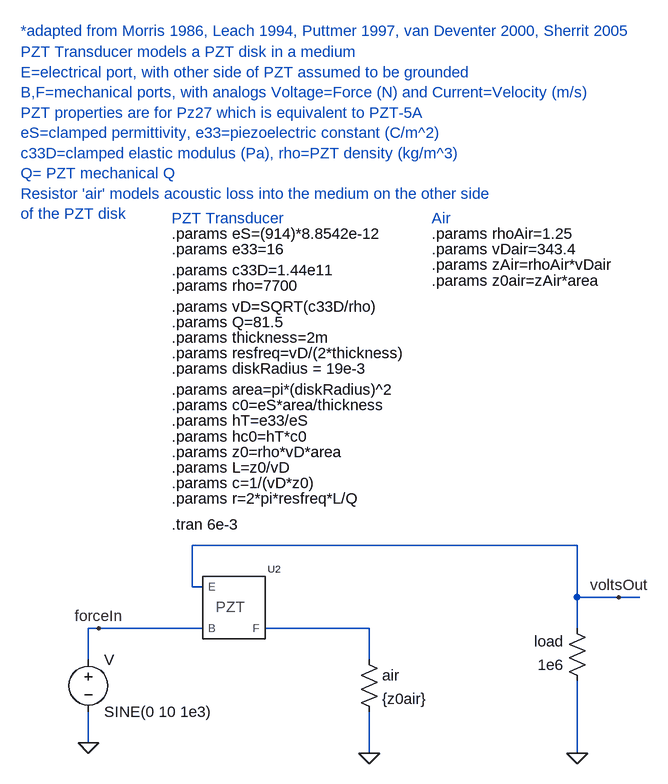
[diagram p0: schematic pzt.asc]
pzt.asc, the LTspice schematic file:
Version 4
SHEET 1 952 680
WIRE 464 48 -128 48
WIRE -128 112 -128 48
WIRE -112 112 -128 112
WIRE 464 128 464 48
WIRE 528 128 464 128
WIRE 560 128 528 128
WIRE -272 176 -288 176
WIRE -112 176 -272 176
WIRE 144 176 -16 176
WIRE 464 176 464 128
WIRE -288 224 -288 176
WIRE 144 224 144 176
WIRE -288 352 -288 304
WIRE 144 368 144 304
WIRE 464 368 464 256
FLAG -288 352 0
FLAG 464 368 0
FLAG 528 128 voltsOut
FLAG -272 176 forceIn
FLAG 144 368 0
SYMBOL res 128 208 R0
SYMATTR InstName air
SYMATTR Value {z0air}
SYMBOL res 480 272 R180
WINDOW 0 36 76 Left 0
WINDOW 3 36 40 Left 0
SYMATTR InstName load
SYMATTR Value 1e6
SYMBOL voltage -288 208 R0
WINDOW 123 0 0 Left 0
WINDOW 39 0 0 Left 0
SYMATTR InstName V
SYMATTR Value SINE(0 10 1e3)
SYMBOL PZT -64 144 R0
SYMATTR InstName U2
TEXT -160 16 Left 0 !.tran 6e-3
TEXT -392 -744 Left 0 ;*adapted from Morris 1986, Leach 1994, Puttmer 1997, van Deventer 2000, Sherrit 2005
TEXT 240 -456 Left 0 ;Air
TEXT -160 -408 Left 0 !.params e33=16
TEXT -160 -352 Left 0 !.params rho=7700
TEXT -160 -320 Left 0 !.params vD=SQRT(c33D/rho)
TEXT -160 -272 Left 0 !.params thickness=2m
TEXT -160 -296 Left 0 !.params Q=81.5
TEXT -160 -248 Left 0 !.params resfreq=vD/(2*thickness)
TEXT -160 -456 Left 0 ;PZT Transducer
TEXT -160 -192 Left 0 !.params area=pi*(diskRadius)^2
TEXT -160 -168 Left 0 !.params c0=eS*area/thickness
TEXT -160 -144 Left 0 !.params hT=e33/eS
TEXT -160 -120 Left 0 !.params hc0=hT*c0
TEXT -160 -24 Left 0 !.params r=2*pi*resfreq*L/Q
TEXT -160 -72 Left 0 !.params L=z0/vD
TEXT -160 -96 Left 0 !.params z0=rho*vD*area
TEXT -160 -48 Left 0 !.params c=1/(vD*z0)
TEXT 240 -384 Left 0 !.params zAir=rhoAir*vDair
TEXT 240 -360 Left 0 !.params z0air=zAir*area
TEXT 240 -432 Left 0 !.params rhoAir=1.25
TEXT 240 -408 Left 0 !.params vDair=343.4
TEXT -160 -376 Left 0 !.params c33D=1.44e11
TEXT -160 -432 Left 0 !.params eS=(914)*8.8542e-12
TEXT -392 -712 Left 0 ;PZT Transducer models a PZT disk in a medium\nE=electrical port, with other side of PZT assumed to be grounded\nB,F=mechanical ports, with analogs Voltage=Force (N) and Current=Velocity (m/s)\nPZT properties are for Pz27 which is equivalent to PZT-5A\neS=clamped permittivity, e33=piezoelectric constant (C/m^2)\nc33D=clamped elastic modulus (Pa), rho=PZT density (kg/m^3) \nQ= PZT mechanical Q\nResistor 'air' models acoustic loss into the medium on the other side\nof the PZT disk
TEXT -160 -224 Left 0 !.params diskRadius = 19e-3

The netlist it stands for:
* pzt.asc
R§air N001 0 {z0air}
R§load 0 voltsOut 1e6
V forceIn 0 SINE(0 10 1e3)
XU2 voltsOut forceIn N001 PZT  ; pins E B F
.tran 6e-3
* *adapted from Morris 1986, Leach 1994, Puttmer 1997, van Deventer 2000, Sherrit 2005
* Air
.params e33=16
.params rho=7700
.params vD=SQRT(c33D/rho)
.params thickness=2m
.params Q=81.5
.params resfreq=vD/(2*thickness)
* PZT Transducer
.params area=pi*(diskRadius)^2
.params c0=eS*area/thickness
.params hT=e33/eS
.params hc0=hT*c0
.params r=2*pi*resfreq*L/Q
.params L=z0/vD
.params z0=rho*vD*area
.params c=1/(vD*z0)
.params zAir=rhoAir*vDair
.params z0air=zAir*area
.params rhoAir=1.25
.params vDair=343.4
.params c33D=1.44e11
.params eS=(914)*8.8542e-12
* PZT Transducer models a PZT disk in a medium
* E=electrical port, with other side of PZT assumed to be grounded
* B,F=mechanical ports, with analogs Voltage=Force (N) and Current=Velocity (m/s)
* PZT properties are for Pz27 which is equivalent to PZT-5A
* eS=clamped permittivity, e33=piezoelectric constant (C/m^2)
* c33D=clamped elastic modulus (Pa), rho=PZT density (kg/m^3)
* Q= PZT mechanical Q
* Resistor 'air' models acoustic loss into the medium on the other side
* of the PZT disk
.params diskRadius = 19e-3
.lib PZT.lib
.backanno
.end